# Altium schematic sheet hall_filters.SchDoc
size 297 x 210 mm
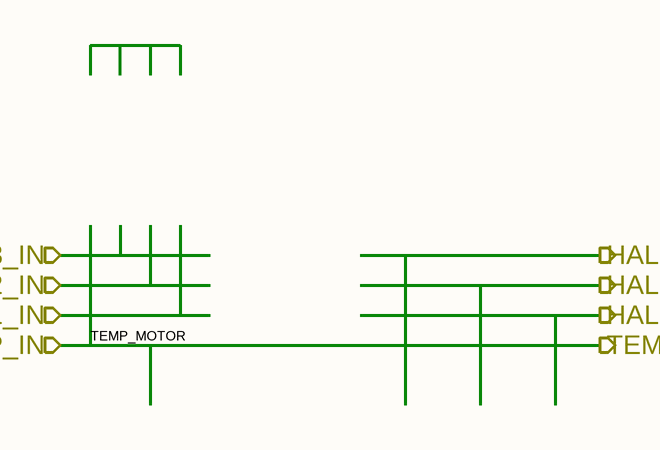
[diagram p0: hall_filters.SchDoc]

## Ports
HALL1_IN (in), HALL1_OUT (out), HALL2_IN (in), HALL2_OUT (out), HALL3_IN (in), HALL3_OUT (out), TEMP_IN (in), TEMP_OUT (out)

## Nets
TEMP_MOTOR: port TEMP_IN, port TEMP_OUT

## Notes on the sheet
- 1
- 2
- 3
- 4
- 5
- 6
- A
- B
- C
- D
- Title: BLDC Driver 4.11
- File: hall_filters.sch
- Sheet: /
- Benjamin Vedder
- KiCad E.D.A.  kicad (5.1.4)-1
- Size: A4
- Date: 21 aug 2015
- Rev: 4.12
- Id: 5/7